# EAGLE schematic shutdown (EAGLE 9.6.1)
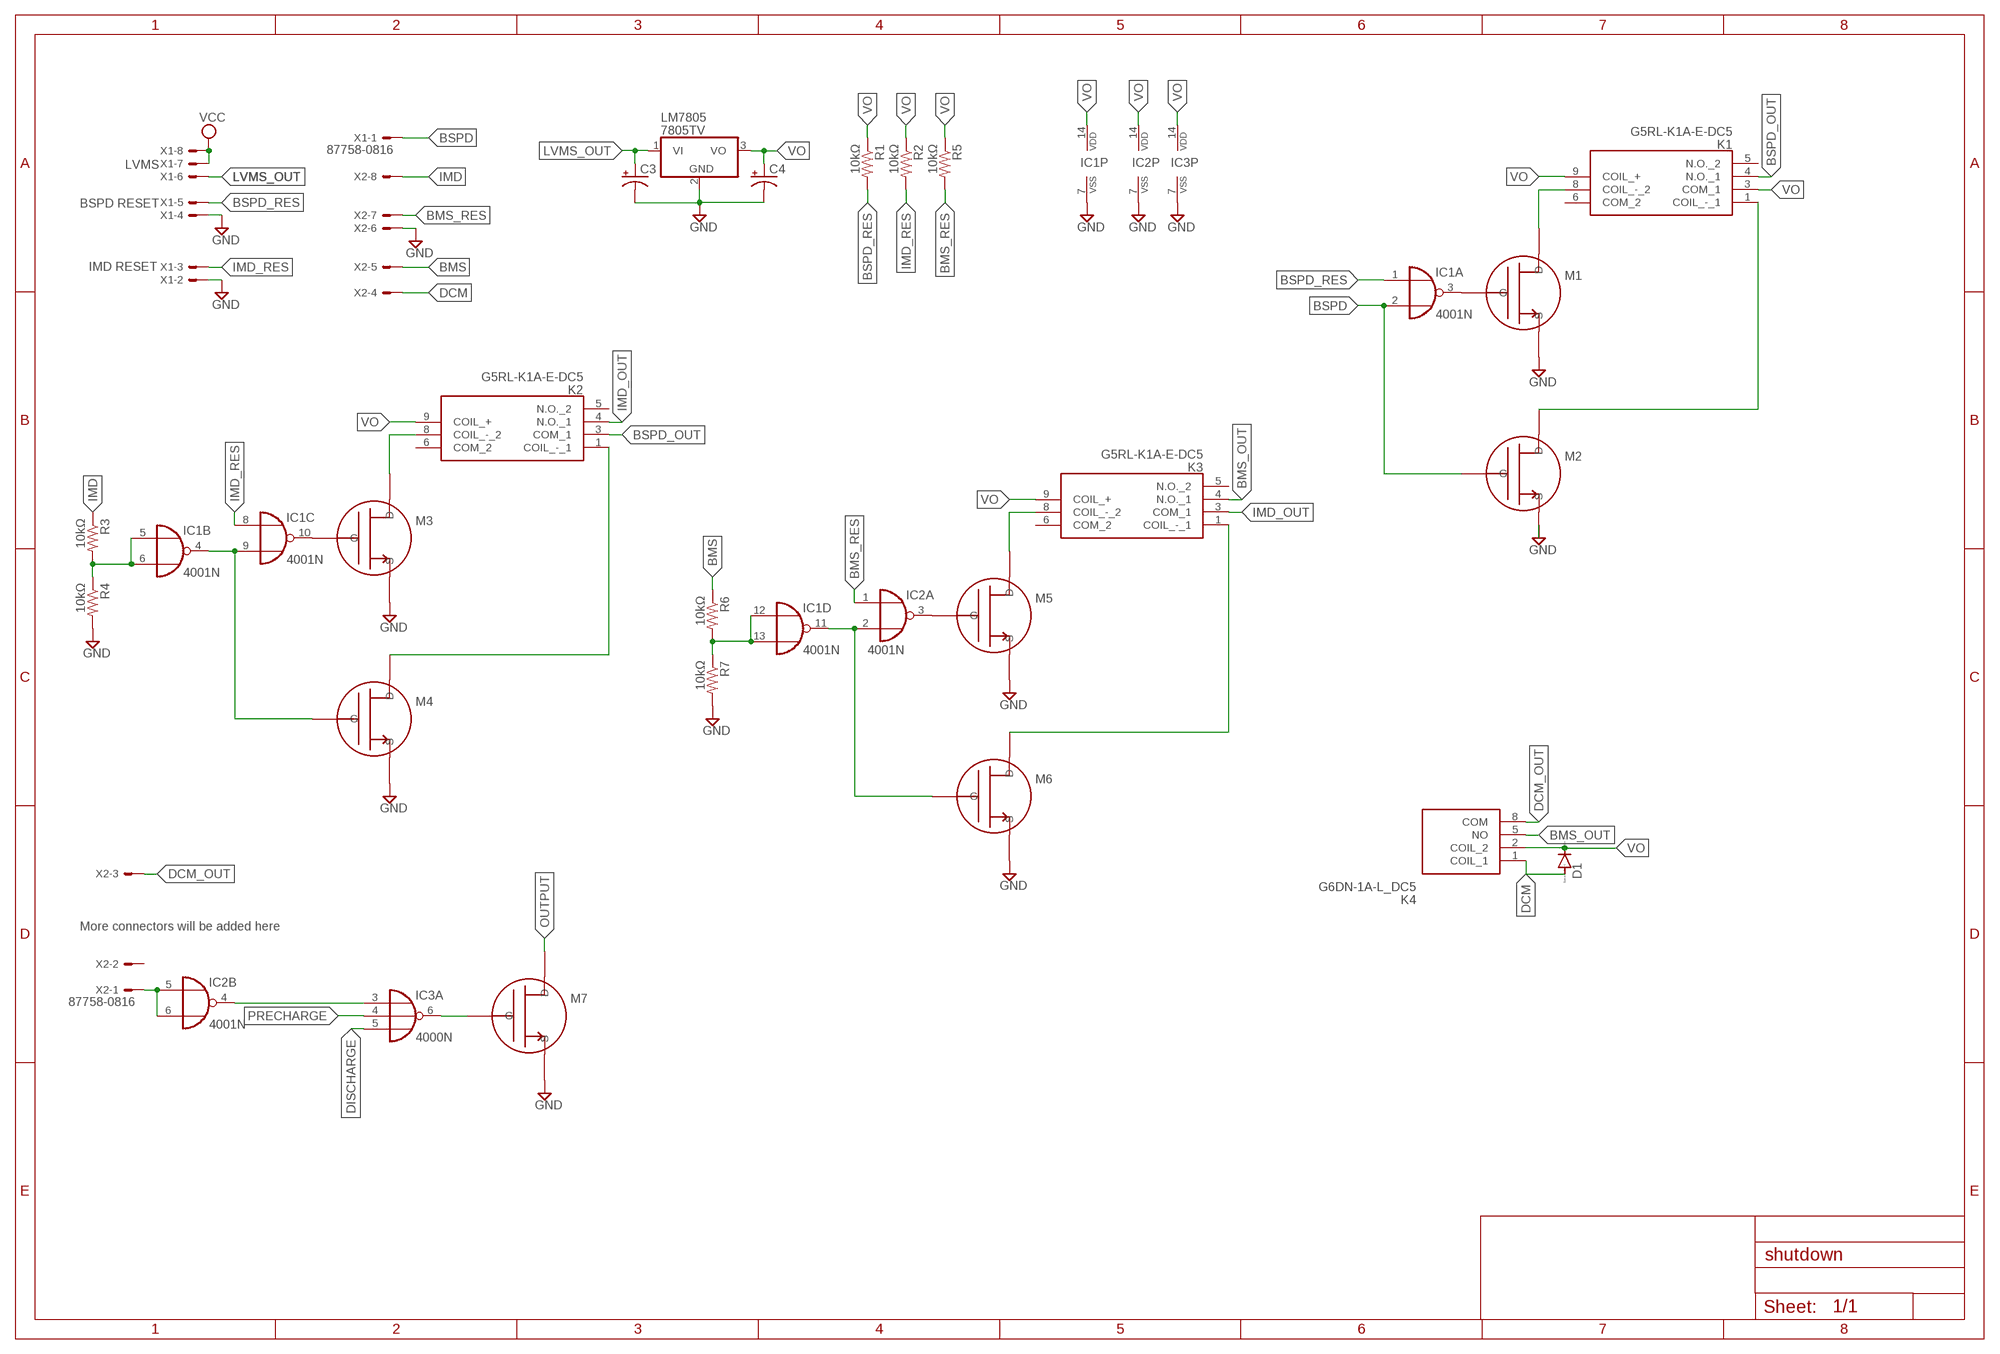
[diagram p0: schematic, sheet 1]

## Parts
C3  CPOL-USE3.5-8  [E3,5-8]
C4  CPOL-USE3.5-8  [E3,5-8]
D1  1N4148DO35-10  [DO35-10]
IC1  4001N  [DIL14]
IC2  4001N  [DIL14]
IC3  4000N  [DIL14]
K1  G5RL-K1A-E-DC5  [G5RLK1AE]
K2  G5RL-K1A-E-DC5  [G5RLK1AE]
K3  G5RL-K1A-E-DC5  [G5RLK1AE]
K4  G6DN-1A-L_DC5  [G6DN-1A-L]
LM7805  7805TV  [TO220V]
M1  FET_N  (no package)
M2  FET_N  (no package)
M3  FET_N  (no package)
M4  FET_N  (no package)
M5  FET_N  (no package)
M6  FET_N  (no package)
M7  FET_N  (no package)
R1  10kΩ  R-US_0207/12  [0207/12]
R2  10kΩ  R-US_0207/12  [0207/12]
R3  10kΩ  R-US_0207/12  [0207/12]
R4  10kΩ  R-US_0207/12  [0207/12]
R5  10kΩ  R-US_0207/12  [0207/12]
R6  10kΩ  R-US_0207/12  [0207/12]
R7  10kΩ  R-US_0207/12  [0207/12]
X1  87758-0816  [87758-0816]
X2  87758-0816  [87758-0816]

## Nets
BMS: R6.1 X2.5
BMS_OUT: K3.4(N.O._1) K4.5(NO)
BMS_RES: IC2.1(A:I0) R5.2 X2.7
BSPD: IC1.2(A:I1) M2.G X1.1
BSPD_OUT: K1.4(N.O._1) K2.3(COM_1)
BSPD_RES: IC1.1(A:I0) R1.2 X1.5
DCM: D1.A K4.1(COIL_1) X2.4
DCM_OUT: K4.8(COM) X2.3
DISCHARGE: IC3.5(A:I2)
GND: C3.- C4.- IC1.7(P:VSS) IC2.7(P:VSS) IC3.7(P:VSS) LM7805.2(GND) M1.S M2.S M3.S M4.S M5.S M6.S M7.S R4.2 R7.2 X1.2 X1.4 X2.6
IMD: IC1.5(B:I0) IC1.6(B:I1) IC1.12(D:I0) IC1.13(D:I1) R3.2 R4.1 R6.2 R7.1 X2.8
IMD_OUT: K2.4(N.O._1) K3.3(COM_1)
IMD_RES: IC1.8(C:I0) R2.2 X1.3
LVMS_OUT: C3.+ LM7805.1(VI) X1.6
N$1: IC1.3(A:O) M1.G
N$3: K1.8(COIL_-_2) M1.D
N$4: K1.1(COIL_-_1) M2.D
N$5: IC1.10(C:O) M3.G
N$6: K2.8(COIL_-_2) M3.D
N$7: IC1.4(B:O) IC1.9(C:I1) M4.G
N$8: K2.1(COIL_-_1) M4.D
N$9: K3.8(COIL_-_2) M5.D
N$10: K3.1(COIL_-_1) M6.D
N$11: IC1.11(D:O) IC2.2(A:I1) M6.G
N$12: IC2.3(A:O) M5.G
N$13: IC2.5(B:I0) IC2.6(B:I1) X2.1
N$14: IC2.4(B:O) IC3.3(A:I0)
N$15: IC3.6(A:O) M7.G
OUTPUT: M7.D
PRECHARGE: IC3.4(A:I1)
VCC: X1.7 X1.8
VO: C4.+ D1.C IC1.14(P:VDD) IC2.14(P:VDD) IC3.14(P:VDD) K1.3(COM_1) K1.9(COIL_+) K2.9(COIL_+) K3.9(COIL_+) K4.2(COIL_2) LM7805.3(VO) R1.1 R2.1 R5.1
Unconnected: IC2.8(C:I0) IC2.9(C:I1) IC2.10(C:O) IC2.11(D:O) IC2.12(D:I0) IC2.13(D:I1) IC3.8(C:I) IC3.9(C:O) IC3.10(B:O) IC3.11(B:I2) IC3.12(B:I1) IC3.13(B:I0) K1.5(N.O._2) K1.6(COM_2) K2.5(N.O._2) K2.6(COM_2) K3.5(N.O._2) K3.6(COM_2) R3.1 X2.2

## Notes on the sheet
- LVMS
- BSPD RESET
- IMD RESET
- More connectors will be added here

## Library data of the parts
C3 C4 = rcl:CPOL-US: POLARIZED CAPACITOR, American symbol; SPICEPREFIX: C
D1 = diode:1N4148: DIODE high speed (Philips)
IC1 IC2 = 40xx:4001: Quad 2-input NOR
IC3 = 40xx:4000: Dual 3-input NOR & INVERTER
K1-K3 = G5RL-K1A-E-DC5:G5RL-K1A-E-DC5: General Purpose Relays 16A hi swtch curent latching relay Source: Datasheet <https://omronfs.omron.com/en_US/ecb/products/pdf/en-g5rl_uk.pdf>; ARROW_PART_NUMBER: G5RL-K1A-E-DC5; DESCRIPTION: General Purpose Relays 16A hi swtch curent latching relay; HEIGHT: mm; MANUFACTURER_NAME: Omron Electronics; MANUFACTURER_PART_NUMBER: G5RL-K1A-E-DC5; MOUSER_PART_NUMBER: 653-G5RLK1AEDC5; MOUSER_PRICE-STOCK: https://www.mouser.co.uk/ProductDetail/Omron-Electronics/G5RL-K1A-E-DC5?qs=9CM3gX%252B2VGG8PNrWkXlGsw%3D%3D
K4 = G6DN-1A-L_DC5:G6DN-1A-L_DC5: OMRON ELECTRONIC COMPONENTS - G6DN-1A-L DC5. - POWER RELAY, SPST-NO, 5A, 250VAC, TH Source: Datasheet <http://omronfs.omron.com/en_US/ecb/products/pdf/en-g6dn.>; ARROW_PART_NUMBER: G6DN-1A-L DC5; ARROW_PRICE-STOCK: https://www.arrow.com/en/products/g6dn-1a-ldc5/omron; DESCRIPTION: OMRON ELECTRONIC COMPONENTS - G6DN-1A-L DC5. - POWER RELAY, SPST-NO, 5A, 250VAC, TH; HEIGHT: mm; MANUFACTURER_NAME: Omron Electronics; MANUFACTURER_PART_NUMBER: G6DN-1A-L DC5; MOUSER_PART_NUMBER: 653-G6DN-1A-LDC5; MOUSER_PRICE-STOCK: https://www.mouser.co.uk/ProductDetail/Omron-Electronics/G6DN-1A-L-DC5?qs=Mv7BduZupUhZB902RCoZGQ%3D%3D
LM7805 = linear:78*: Positive VOLTAGE REGULATOR Source: http://cache.national.com/ds/LM/LM78L05.pdf http://www.fairchildsemi.com/ds/LM/LM7805.pdf
M1-M7 = ngspice-simulation:FET_N: N-Type MOS Field Effect Transistor (MOSFET)
R1-R7 = rcl:R-US_: RESISTOR, American symbol; SPICEPREFIX: R
X1 X2 = con-molex:87758-0816: 8 Pin - 2mm Dual Row Single Wafer, Vertical T/H HDR Source: http://www.molex.com/pdm_docs/sd/877580616_sd.pdf; MF: MOLEX; MPN: 87758-0816; OC_FARNELL: 7472331; OC_NEWARK: 59J1556; SPICEPREFIX: X

## Net classes
0 default: width 0.305 mm, drill 0.508 mm, clearance 0.254 mm